# EAGLE schematic AQE_SENSORMODULE_E2V_CMOS (EAGLE 6.1)
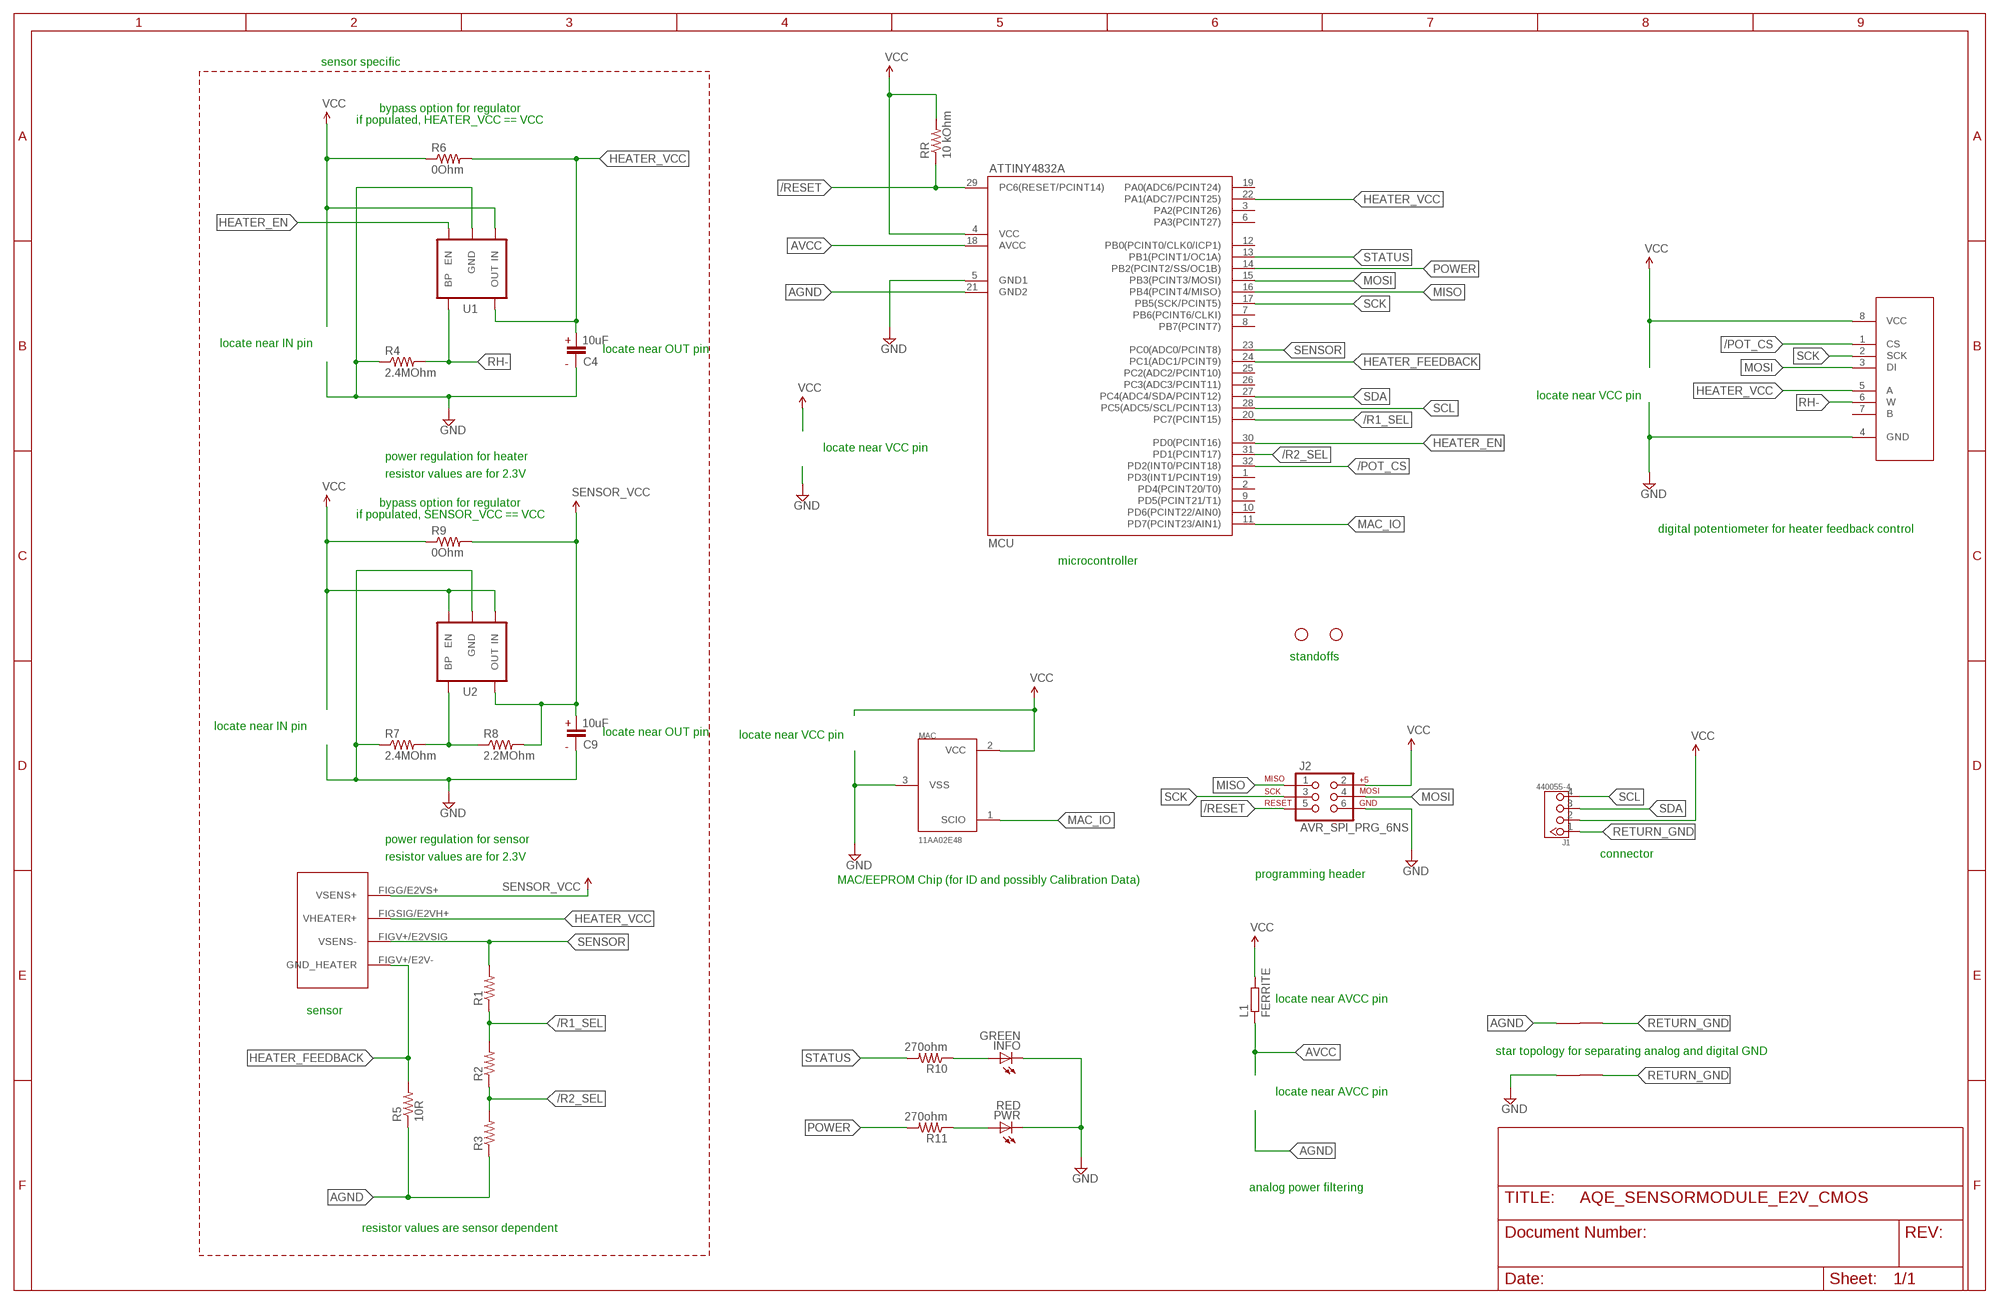
[diagram p0: schematic, sheet 1]

## Parts
C4  10uF  EEE-1EA100WR  [TYPE-B_ALUMINUM_CAN]
C9  10uF  EEE-1EA100WR  [TYPE-B_ALUMINUM_CAN]
GAS  E2V  [SR-4]
INFO  GREEN  LEDCHIPLED_0805  [CHIPLED_0805]
J1  440055-4  TWIG_2.0-DIP-FEMALED  [2.0_1X4_90]
J2  AVR_SPI_PRG_6NS  [2X3-NS]
JP1  STAND-OFF  [STAND-OFF]
JP2  STAND-OFF  [STAND-OFF]
L1  FERRITE  RCL_R-EU_R0805  [RCL_R0805]
MAC  11AA02E48  [SOT23]
MCU  ATTINY4832A  [TQFP32-08]
PWR  RED  LEDCHIPLED_0805  [CHIPLED_0805]
R1  RESISTOR0805-RES  [0805]
R2  RESISTOR0805-RES  [0805]
R3  RESISTOR0805-RES  [0805]
R4  2.4MOhm  RESISTOR0805-RES  [0805]
R5  10R  RESISTOR0805-RES  [0805]
R6  0Ohm  RESISTOR0805-RES  [0805]
R7  2.4MOhm  RESISTOR0805-RES  [0805]
R8  2.2MOhm  RESISTOR0805-RES  [0805]
R9  0Ohm  RESISTOR0805-RES  [0805]
R10  270ohm  RESISTOR0805-RES  [0805]
R11  270ohm  RESISTOR0805-RES  [0805]
RR  10 kOhm  RESISTOR0805-RES  [0805]
U1  V_REG_LDOSMD  [SOT23-5]
U2  V_REG_LDOSMD  [SOT23-5]
U3  MCP41XXX  [SO08]
U$2  PLANE_COUPLER  [PLANE_COUPLER]
U$3  PLANE_COUPLER  [PLANE_COUPLER]

## Nets
/POT_CS: MCU.32(PD2(INT0/PCINT18)) U3.1(CS)
/R1_SEL: MCU.20(PC7(PCINT15)) R1.1 R2.2
/R2_SEL: MCU.31(PD1(PCINT17)) R2.1 R3.2
/RESET: J2.5 MCU.29(PC6(RESET/PCINT14)) RR.1
AGND: C1.2 MCU.21(GND2) R3.1 R5.1 U$2.1
AVCC: C1.1 L1.1 MCU.18(AVCC)
GND: C2.2 C3.1 C4.P$2 C5.2 C6.2 C8.1 C9.P$2 INFO.C J2.6 MAC.3(VSS) MCU.5(GND1) PWR.C R4.1 R7.1 U1.2(GND) U2.2(GND) U3.4(GND) U$3.1
HEATER_EN: MCU.30(PD0(PCINT16)) U1.3(EN)
HEATER_FEEDBACK: GAS.FIGV+/E2V-(GND_HEATER) MCU.24(PC1(ADC1/PCINT9)) R5.2
HEATER_VCC: C4.P$1 GAS.FIGSIG/E2VH+(VHEATER+) MCU.22(PA1(ADC7/PCINT25)) R6.2 U1.5(OUT) U3.5(A)
MAC_IO: MAC.1(SCIO) MCU.11(PD7(PCINT23/AIN1))
MISO: J2.1 MCU.16(PB4(PCINT4/MISO))
MOSI: J2.4 MCU.15(PB3(PCINT3/MOSI)) U3.3(DI)
N$2: R7.2 R8.1 U2.4(BP)
N$3: PWR.A R11.1
N$4: INFO.A R10.1
POWER: MCU.14(PB2(PCINT2/SS/OC1B)) R11.2
RETURN_GND: J1.1 U$2.2 U$3.2
RH-: R4.2 U1.4(BP) U3.6(W)
SCK: J2.3 MCU.17(PB5(SCK/PCINT5)) U3.2(SCK)
SCL: J1.4 MCU.28(PC5(ADC5/SCL/PCINT13))
SDA: J1.3 MCU.27(PC4(ADC4/SDA/PCINT12))
SENSOR: GAS.FIGV+/E2VSIG(VSENS-) MCU.23(PC0(ADC0/PCINT8)) R1.2
SENSOR_VCC: C9.P$1 GAS.FIGG/E2VS+(VSENS+) R8.2 R9.2 U2.5(OUT)
STATUS: MCU.13(PB1(PCINT1/OC1A)) R10.2
VCC: C2.1 C3.2 C5.1 C6.1 C8.2 J1.2 J2.2 L1.2 MAC.2(VCC) MCU.4(VCC) R6.1 R9.1 RR.2 U1.1(IN) U2.1(IN) U2.3(EN) U3.8(VCC)
Unconnected: MCU.1(PD3(INT1/PCINT19)) MCU.2(PD4(PCINT20/T0)) MCU.3(PA2(PCINT26)) MCU.6(PA3(PCINT27)) MCU.7(PB6(PCINT6/CLKI)) MCU.8(PB7(PCINT7)) MCU.9(PD5(PCINT21/T1)) MCU.10(PD6(PCINT22/AIN0)) MCU.12(PB0(PCINT0/CLK0/ICP1)) MCU.19(PA0(ADC6/PCINT24)) MCU.25(PC2(ADC2/PCINT10)) MCU.26(PC3(ADC3/PCINT11)) U3.7(B)

## Notes on the sheet
- sensor specific
- bypass option for regulator
- if populated, HEATER_VCC == VCC
- locate near IN pin | 10uF
- locate near OUT pin
- locate near VCC pin
- locate near VCC pin
- power regulation for heater
- resistor values are for 2.3V
- bypass option for regulator
- if populated, SENSOR_VCC == VCC
- digital potentiometer for heater feedback control
- microcontroller
- standoffs
- locate near IN pin | 10uF
- locate near OUT pin | locate near VCC pin
- power regulation for sensor
- resistor values are for 2.3V | connector
- programming header
- MAC/EEPROM Chip (for ID and possibly Calibration Data)
- locate near AVCC pin
- sensor
- star topology for separating analog and digital GND
- locate near AVCC pin
- analog power filtering
- resistor values are sensor dependent

## Library data of the parts
C4 C9 = wicked-device:EEE-1EA100WR
GAS = ricardo:E2V
INFO PWR = adafruit:LED: LED OSRAM: - CHIPLED LG R971, LG N971, LY N971, LG Q971, LY Q971, LO R971, LY R971 LH N974, LH R974 LS Q976, LO Q976, LY Q976 LO Q996 - Hyper CHIPLED LW Q18S LB Q993, LB Q99A, LB R99A - SideLED LS A670, LO A670, LY A670, LG A670, LP A670 LB A673, LV A673, LT A673, LW A673 LH A674 LY A675 LS A676, LA A676, LO A676, LY A676, LW A676 LS A679, LY A679, LG A679 - Hyper Micro SIDELED® LS Y876, LA Y876, LO Y876, LY Y876 LT Y87S - SmartLED LW L88C, LW L88S LB L89C, LB L89S, LG L890 LS L89K, LO L89K, LY L89K LS L896, LA L896, LO L896, LY L896 - TOPLED LS T670, LO T670, LY T670, LG T670, LP T670 LSG T670, LSP T670, LSY T670, LOP T670, LYG T670 LG T671, LOG T671, LSG T671 LB T673, LV T673, LT T673, LW T673 LH T674 LS T676, LA T676, LO T676, LY T676, LB T676, LH T676, LSB T676, LW T676 LB T67C, LV T67C, LT T67C, LS T67K, LO T67K, LY T67K, LW E67C LS E67B, LA E67B, LO E67B, LY E67B, LB E67C, LV E67C, LT E67C LW T67C LS T679, LY T679, LG T679 LS T770, LO T770, LY T770, LG T770, LP T770 LB T773, LV T773, LT T773, LW T773 LH T774 LS E675, LA E675, LY E675, LS T675 LS T776, LA T776, LO T776, LY T776, LB T776 LHGB T686 LT T68C, LB T68C - Hyper Mini TOPLED® LB M676 - Mini TOPLED Santana® LG M470 LS M47K, LO M47K, LY M47K Source: http://www.osram.convergy.de/
J1 = Connector:TWIG_2.0-DIP-FEMALE
J2 = SparkFun:AVR_SPI_PRG_6: AVR ISP 6 Pin This is the reduced ISP connector for AVR programming. Common on Arduino. This footprint will take up less PCB space and can be used with a 10-pin to 6-pin adapter such as SKU: BOB-08508
JP1 JP2 = SparkFun:STAND-OFF: Stand Off This is the mechanical footprint for a #4 phillips button head screw. Use the keepout ring to avoid running the screw head into surrounding components. SKU : PRT-00447
L1 = nanodeRF_11:RCL_R-EU_: RESISTOR, European symbol
MAC = nanode:11AA02E48
MCU = axeio-SparkFun:ATTINY48: ATtiny48/88 in 32 pin configuration.
R1-R11 RR = SparkFun:RESISTOR: Resistor Basic schematic elements and footprints for 0603, 1206, and PTH resistors.
U1 U2 = SparkFun:V_REG_LDO: Voltage Regulator LDO Standard 150mA LDO voltage regulator in SOT-23 layout. Micrel part MIC5205. BP (by-pass) pin is used to lower output noise with 470pF cap.
U3 = SparkFun-AnalogIC:MCP41XXX: SPI controlled single digital potentiometer by Microchip
U$2 U$3 = wicked-device:PLANE_COUPLER